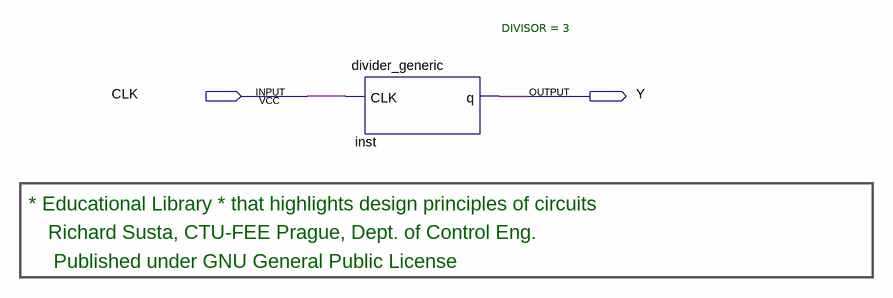
[diagram p0: schematic sheet]
// Quartus schematic divider3.bdf as structural Verilog: 1 symbols, 2 pins
module divider3 (
  input  CLK,
  output Y
);

  divider_generic #(.DIVISOR(3)) inst (.CLK(CLK), .q(Y));

  // Notes on the sheet:
  //   * Educational Library * that highlights design principles of circuits
  //   Richard Susta, CTU-FEE Prague, Dept. of Control Eng. 
  //    Published under GNU General Public License
endmodule
